# EAGLE design protoCuantumv2 (EAGLE 9.6.2)
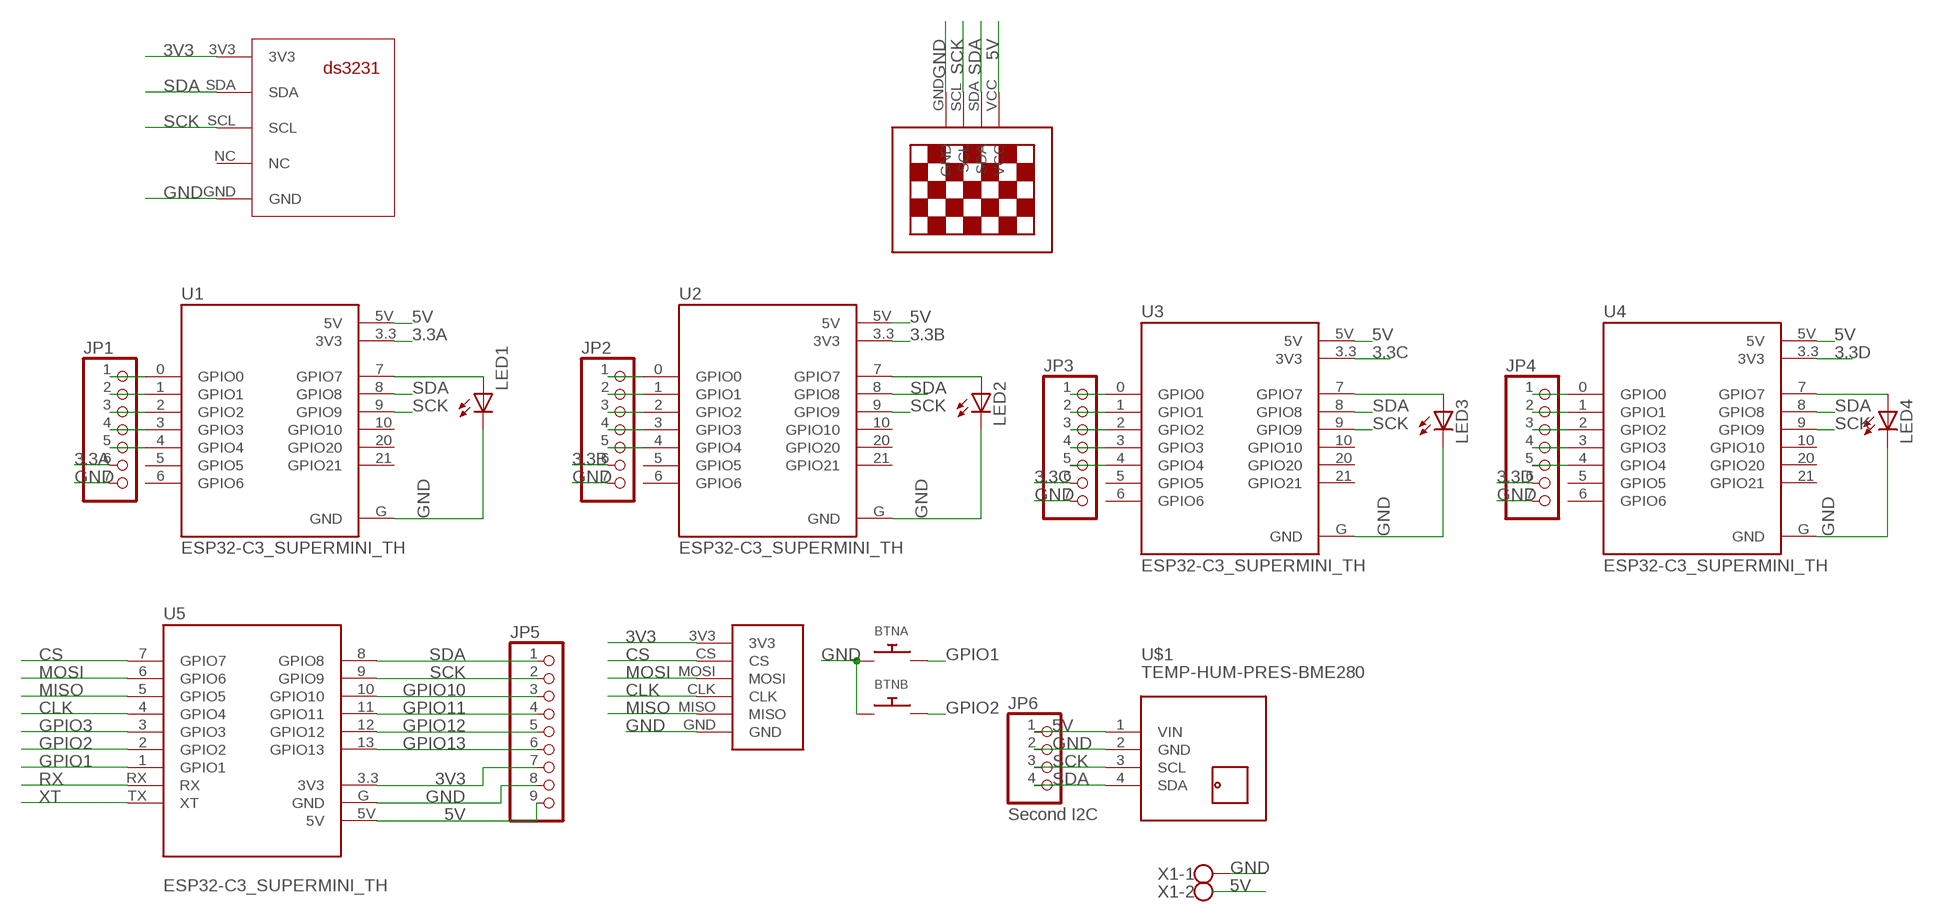
[diagram p0: schematic, sheet 1]

## Parts
BTNA  SWITCH_PUSHBUTTONEVQ-PE  [TACT_PANA-EVQ]
BTNB  SWITCH_PUSHBUTTONEVQ-PE  [TACT_PANA-EVQ]
JP1  PINHD-1X7  [1X07]
JP2  PINHD-1X7  [1X07]
JP3  PINHD-1X7  [1X07]
JP4  PINHD-1X7  [1X07]
JP5  PINHD-1X9  [1X09]
JP6  Second I2C  PINHD-1X4  [1X04]
LED1  LED3MM  [LED3MM]
LED2  LED3MM  [LED3MM]
LED3  LED3MM  [LED3MM]
LED4  LED3MM  [LED3MM]
U1  ESP32-C3_SUPERMINI_TH  [MODULE_ESP32-C3_SUPERMINI_TH]
U2  ESP32-C3_SUPERMINI_TH  [MODULE_ESP32-C3_SUPERMINI_TH]
U3  ESP32-C3_SUPERMINI_TH  [MODULE_ESP32-C3_SUPERMINI_TH]
U4  ESP32-C3_SUPERMINI_TH  [MODULE_ESP32-C3_SUPERMINI_TH]
U5  ESP32-C3_SUPERMINI_TH  [MODULE_ESP32-C3_SUPERMINI_TH]
U$1  TEMP-HUM-PRES-BME280  [TEMP-HUM-PRES-BME280]
U$2  SD_KUSKALLA  [SD_KUSKALLA]
U$3  13"OLED13"OLED  [1.3"OLED]
U$4  RTC  [RTCDS3231FP]
X1  W237-102  [W237-102]

## Nets
3.3A: JP1.6 U1.3.3(3V3)
3.3B: JP2.6 U2.3.3(3V3)
3.3C: JP3.6 U3.3.3(3V3)
3.3D: JP4.6 U4.3.3(3V3)
3V3: JP5.7 U5.3.3(3V3) U$2.3V3 U$4.3V3
5V: JP5.9 JP6.1 U1.5V U2.5V U3.5V U4.5V U5.5V U$1.1(VIN) U$3.VCC X1.2
CLK: U5.4(GPIO4) U$2.CLK
CS: U5.7(GPIO7) U$2.CS
GND: BTNA.P$1 BTNB.P$1 JP1.7 JP2.7 JP3.7 JP4.7 JP5.8 JP6.2 LED1.K(C) LED2.K(C) LED3.K(C) LED4.K(C) U1.G(GND) U2.G(GND) U3.G(GND) U4.G(GND) U5.G(GND) U$1.2(GND) U$2.GND U$3.GND U$4.GND X1.1
GPIO1: BTNA.P$2 U5.1(GPIO1)
GPIO2: BTNB.P$2 U5.2(GPIO2)
GPIO3: U5.3(GPIO3)
GPIO10: JP5.3 U5.10(GPIO10)
GPIO11: JP5.4 U5.11(GPIO11)
GPIO12: JP5.5 U5.12(GPIO12)
GPIO13: JP5.6 U5.13(GPIO13)
MISO: U5.5(GPIO5) U$2.MISO
MOSI: U5.6(GPIO6) U$2.MOSI
N$1: LED2.A U2.7(GPIO7)
N$2: JP2.1 U2.0(GPIO0)
N$3: LED1.A U1.7(GPIO7)
N$11: JP4.1 U4.0(GPIO0)
N$12: JP4.2 U4.1(GPIO1)
N$13: LED3.A U3.7(GPIO7)
N$14: LED4.A U4.7(GPIO7)
N$15: JP1.1 U1.0(GPIO0)
N$16: JP1.2 U1.1(GPIO1)
N$17: JP1.3 U1.2(GPIO2)
N$18: JP1.4 U1.3(GPIO3)
N$19: JP1.5 U1.4(GPIO4)
N$20: JP2.2 U2.1(GPIO1)
N$21: JP2.3 U2.2(GPIO2)
N$22: JP2.4 U2.3(GPIO3)
N$23: JP2.5 U2.4(GPIO4)
N$24: JP3.1 U3.0(GPIO0)
N$25: JP3.2 U3.1(GPIO1)
N$26: JP3.3 U3.2(GPIO2)
N$27: JP3.4 U3.3(GPIO3)
N$28: JP3.5 U3.4(GPIO4)
N$29: JP4.3 U4.2(GPIO2)
N$30: JP4.4 U4.3(GPIO3)
N$31: JP4.5 U4.4(GPIO4)
RX: U5.RX
SCK: JP5.2 JP6.3 U1.9(GPIO9) U2.9(GPIO9) U3.9(GPIO9) U4.9(GPIO9) U5.9(GPIO9) U$1.3(SCL) U$3.SCL U$4.SCL
SDA: JP5.1 JP6.4 U1.8(GPIO8) U2.8(GPIO8) U3.8(GPIO8) U4.8(GPIO8) U5.8(GPIO8) U$1.4(SDA) U$3.SDA U$4.SDA
XT: U5.TX(XT)
Unconnected: U1.5(GPIO5) U1.6(GPIO6) U1.10(GPIO10) U1.20(GPIO20) U1.21(GPIO21) U2.5(GPIO5) U2.6(GPIO6) U2.10(GPIO10) U2.20(GPIO20) U2.21(GPIO21) U3.5(GPIO5) U3.6(GPIO6) U3.10(GPIO10) U3.20(GPIO20) U3.21(GPIO21) U4.5(GPIO5) U4.6(GPIO6) U4.10(GPIO10) U4.20(GPIO20) U4.21(GPIO21) U$4.NC

## Library data of the parts
BTNA BTNB = adafruit:SWITCH_PUSHBUTTON: Buttons SOFTTOUCHSMD_SJ - Soft touch temporary push button (Super Junk Akihabara) Compatible with SKPMANE010 [Mouser: 688-SKPMAN] C&K_KSS = Digikey: KSS221GLFS
JP1-JP4 = pinhead:PINHD-1X7: PIN HEADER
JP5 = pinhead:PINHD-1X9: PIN HEADER
JP6 = pinhead:PINHD-1X4: PIN HEADER
LED1-LED4 = adafruit:LED: LED OSRAM: - CHIPLED LG R971, LG N971, LY N971, LG Q971, LY Q971, LO R971, LY R971 LH N974, LH R974 LS Q976, LO Q976, LY Q976 LO Q996 - Hyper CHIPLED LW Q18S LB Q993, LB Q99A, LB R99A - SideLED LS A670, LO A670, LY A670, LG A670, LP A670 LB A673, LV A673, LT A673, LW A673 LH A674 LY A675 LS A676, LA A676, LO A676, LY A676, LW A676 LS A679, LY A679, LG A679 - Hyper Micro SIDELED® LS Y876, LA Y876, LO Y876, LY Y876 LT Y87S - SmartLED LW L88C, LW L88S LB L89C, LB L89S, LG L890 LS L89K, LO L89K, LY L89K LS L896, LA L896, LO L896, LY L896 - TOPLED LS T670, LO T670, LY T670, LG T670, LP T670 LSG T670, LSP T670, LSY T670, LOP T670, LYG T670 LG T671, LOG T671, LSG T671 LB T673, LV T673, LT T673, LW T673 LH T674 LS T676, LA T676, LO T676, LY T676, LB T676, LH T676, LSB T676, LW T676 LB T67C, LV T67C, LT T67C, LS T67K, LO T67K, LY T67K, LW E67C LS E67B, LA E67B, LO E67B, LY E67B, LB E67C, LV E67C, LT E67C LW T67C LS T679, LY T679, LG T679 LS T770, LO T770, LY T770, LG T770, LP T770 LB T773, LV T773, LT T773, LW T773 LH T774 LS E675, LA E675, LY E675, LS T675 LS T776, LA T776, LO T776, LY T776, LB T776 LHGB T686 LT T68C, LB T68C - Hyper Mini TOPLED® LB M676 - Mini TOPLED Santana® LG M470 LS M47K, LO M47K, LY M47K Source: http://www.osram.convergy.de/
U1-U4 = ESP32-C3_SUPERMINI_TH:ESP32-C3_SUPERMINI_TH: Check availability <https://pricing.snapeda.com/parts/ESP32-C3%20SuperMini_TH/Espressif%20Systems/view-part?ref=eda>; AVAILABILITY: Not in stock; CHECK_PRICES: https://www.snapeda.com/parts/ESP32-C3%20SuperMini_TH/Espressif+Systems/view-part/?ref=eda; DESCRIPTION: Super tiny ESP32-C3 board; MF: Espressif Systems; MP: ESP32-C3 SuperMini_TH; PACKAGE: Package; PRICE: None; SNAPEDA_LINK: https://www.snapeda.com/parts/ESP32-C3%20SuperMini_TH/Espressif+Systems/view-part/?ref=snap
U5 = ESP32-S3_SUPERMINI_TH:ESP32-C3_SUPERMINI_TH: Biblioteca modificada para esp32 s3 super mini; AVAILABILITY: Not in stock; DESCRIPTION: Super tiny ESP32-S3; MARCA: model S3 esp32; MF: Espressif Systems; MODEL: esp32 S3; MP: ESP32-S3 SuperMini_TH; PACKAGE: Package
U$1 = diy-modules:TEMP-HUM-PRES-BME280: Digital Humidity-Temperature-Pressure Sensor based on BME280 device More information about BME280 device is available here: https://www.bosch-sensortec.com/bst/products/all_products/bme280 Click here to find device on ebay.com <http://www.ebay.com/sch/bme280+breakout>
U$2 = SD_KUSKALLA:SD_KUSKALLA
U$3 = 13oled:13"OLED
U$4 = rtc for pi ds3231:RTC
X1 = con-wago-500:W237-102: WAGO SCREW CLAMP; MPN: 237-102; OC_FARNELL: unknown; OC_NEWARK: 70K9898

## Board
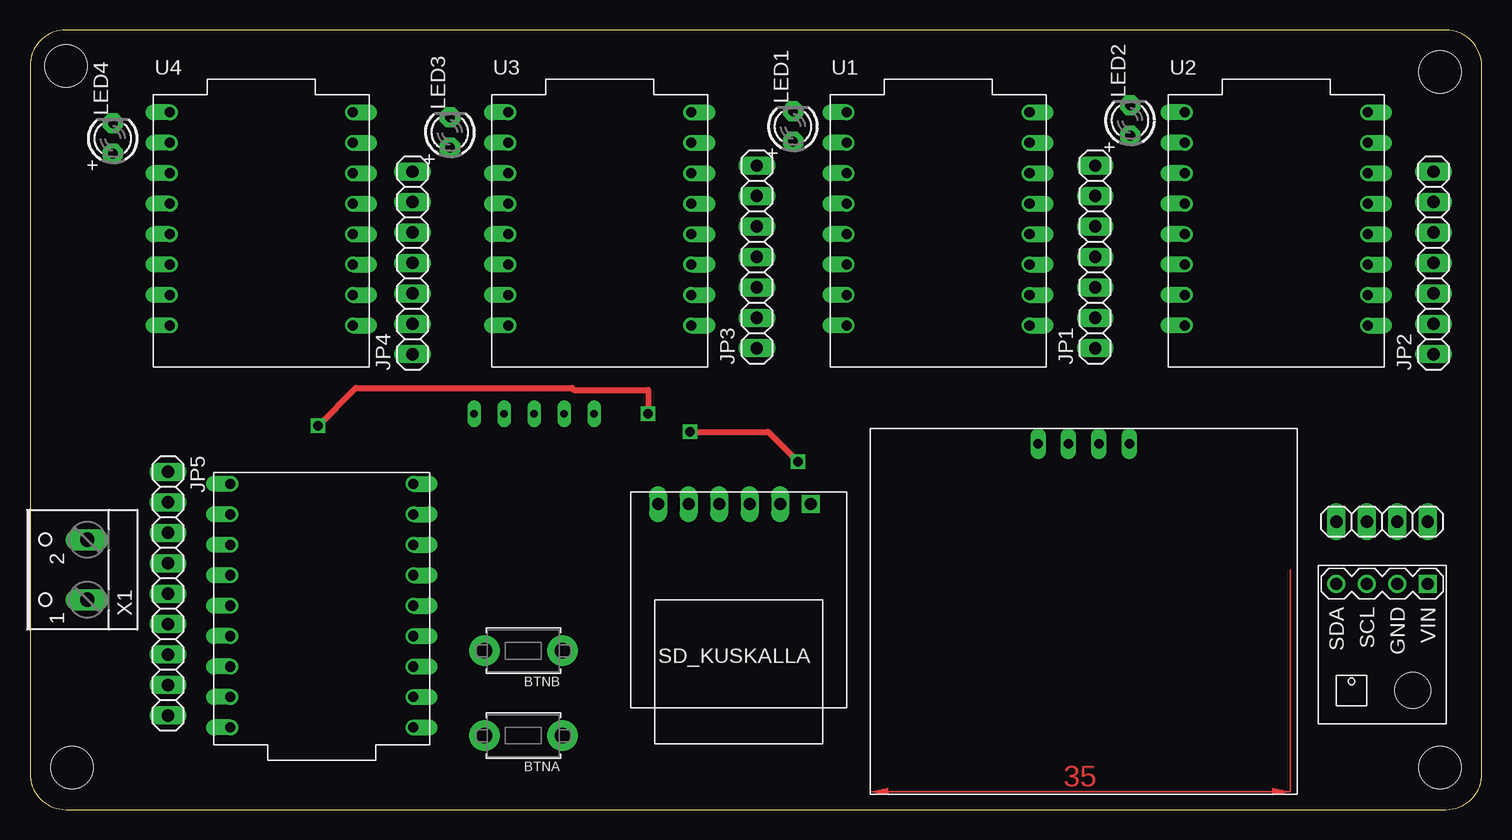
[diagram p1: board, top side]
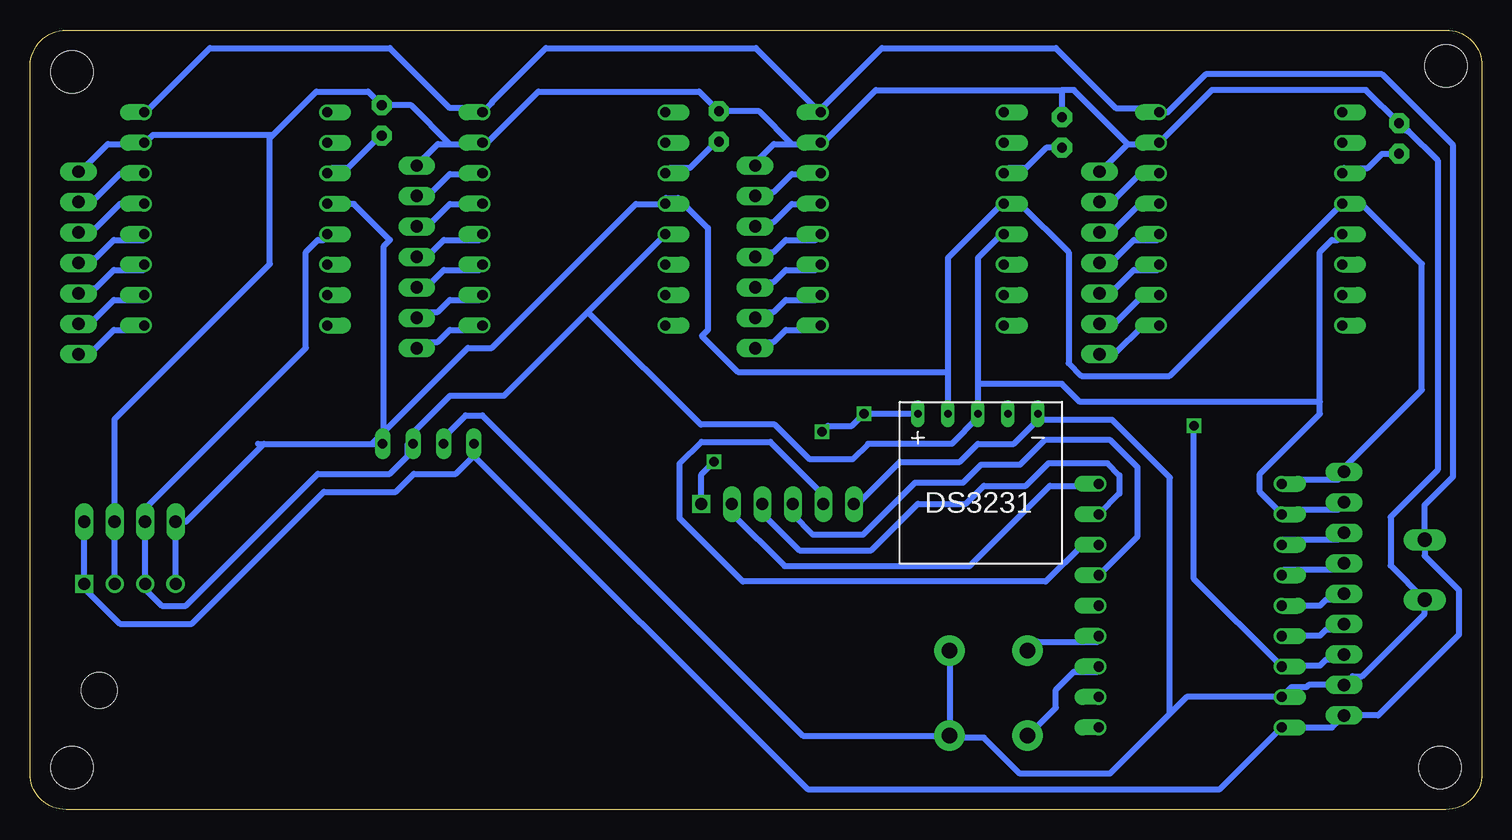
[diagram p2: board, bottom side, seen from below]

Size 121 x 65 mm. Coordinates in mm from the lower left corner, seen from the top.
Outline: 0,62 0,3 arc90 3,0 118,0 arc90 121,3 120.97,62 arc90 117.97,65 3,65 arc90 0,62
Copper layers (1*16): Top 0.035mm / dielectric 1.5mm / Bottom 0.035mm
Design rules "default *": minimum track width 0.5mm, minimum drill 0.8mm, track to track 0.8mm, track to pad 0.8mm, pad to pad 0.8mm, via to via 0.8mm, smd to smd 6mil, copper to edge 40mil, drill to drill 6mil, minimum pad ring 10mil, minimum via ring 8mil, stop-mask expansion 4mil, vias tented up to drill 0mil, thermal gap 10mil
Holes 3.5 mm at 3,62 3.5,3.5 117.5,3.5 117.5,61.5

### Footprints (pad centres in the part's own frame; a part is rotated, then mirrored left to right if it is on the bottom)
TACT_PANA-EVQ = drill 1.3 pad 2.54: P$1 -3.25,0; P$2 3.25,0
1X07 = drill 1.016 long: 1 -7.62,0; 2 -5.08,0; 3 -2.54,0; 4 0,0; 5 2.54,0; 6 5.08,0; 7 7.62,0
1X09 = drill 1.016 long: 1 -10.16,0; 2 -7.62,0; 3 -5.08,0; 4 -2.54,0; 5 0,0; 6 2.54,0; 7 5.08,0; 8 7.62,0; 9 10.16,0
1X04 = drill 1.016 long: 1 -3.81,0; 2 -1.27,0; 3 1.27,0; 4 3.81,0
LED3MM = drill 0.813 pad 1.676 octagon: A -1.27,0; K 1.27,0
MODULE_ESP32-C3_SUPERMINI_TH = drill 0.84 offset: 0 7.62,-7.88; 1 7.62,-5.34; 2 7.62,-2.8; 3 7.62,-0.26; 3.3 7.62,4.82; 4 7.62,2.28; 5 -7.62,9.9; 5V 7.62,9.9; 6 -7.62,7.36; 7 -7.62,4.82; 8 -7.62,2.28; 9 -7.62,-0.26; 10 -7.62,-2.8; 20 -7.62,-5.34; 21 -7.62,-7.88; G 7.62,7.36
MODULE_ESP32-C3_SUPERMINI_TH' = drill 0.84 offset: 1 -7.62,4.82; 2 -7.62,2.28; 3 -7.62,-0.26; 3.3 7.62,4.82; 4 -7.62,-2.8; 5 -7.62,-5.34; 5V 7.62,9.9; 6 -7.62,-7.88; 7 -7.62,-10.42; 8 7.62,-10.42; 9 7.62,-7.88; 10 7.62,-5.34; 11 7.62,-2.8; 12 7.62,-0.26; 13 7.62,2.28; G 7.62,7.36; RX -7.62,7.36; TX -7.62,9.9
TEMP-HUM-PRES-BME280 = drill 1 square: 1 -5.08,3.81 | drill 1: 2 -5.08,1.27; 3 -5.08,-1.27; 4 -5.08,-3.81 | hole 3: 3.81,2.54
SD_KUSKALLA = drill 1 square: 3V3 -8,6 | drill 1 long: CLK -8,-1.62; CS -8,3.46; GND -8,-6.7; MISO -8,-4.16; MOSI -8,0.92
1.3"OLED = drill 0.8 long: GND 2.54,0; SCL 5.08,0; SDA 7.62,0; VCC 0,0
RTCDS3231FP = drill 0.6 long: 3V3 1,12; GND 1,2; NC 1,4.5; SCL 1,7; SDA 1,9.5
W237-102 = drill 1.194 long: 1 -2.5,-1.27; 2 2.5,-1.27

### Placement (x,y rotation side)
BTNA  41.12,6.16 180 top
BTNB  41.12,13.24 180 top
JP1  88.77,46.08 90 top
JP2  116.96,45.58 90 top
JP3  60.57,46.08 90 top
JP4  31.88,45.58 90 top
JP5  11.5,18 270 top
JP6  112.68,24 180 top
LED1  63.59,56.95 90 top
LED2  91.68,57.45 90 top
LED3  35,56.45 90 top
LED4  6.91,55.95 90 top
U1  75.67,48.24 0 top
U2  103.86,48.24 0 top
U3  47.47,48.24 0 top
U4  19.28,48.24 0 top
U5  ESP32-C3_SUPERMINI_TH  [MODULE_ESP32-C3_SUPERMINI_TH']  24.32,16.74 180 top
U$1  112.68,13.74 270 top
U$2  59.05,17.47 270 top
U$3  84,30.5 0 top
U$4  35,34 270 top
X1  3.5,20 90 top

### Tracks (layer width: path | path; a pad name or v marks a point on that pad's centre or on a via)
3.3A
  Bottom 0.5: U1.3.3 83.5,53 86,53 87.5,51.5 88.5,51.5 JP1.6
3.3B
  Bottom 0.5: U2.3.3 111.5,53 113.5,53 115.5,51 116.5,51 JP2.6
3.3C
  Bottom 0.5: U3.3.3 55.5,53 57.5,53 59,51.5 60.5,51.5 JP3.6
3.3D
  Bottom 0.5: U4.3.3 27,53 28.5,53 30.5,51 31.5,51 JP4.6
3V3  (via drill 0.8)
  Top 0.5: v24,32 27.16,35.16 45.16,35.16 45.32,35 51.5,35 v51.5,33 | v55,31.5 61.5,31.5 v64,29
  Bottom 0.5: JP5.7 11.5,12.5 13,12.5 13.5,12 16.5,12 U5.3.3 24,19.22 v24,32 | U$4.3V3 v51.5,33 52.5,32 54.5,32 v55,31.5 | U$2.3V3 65.05,27.95 v64,29
5V
  Bottom 0.5: U2.5V 111,58.5 106,63.5 91,63.5 86,58.5 83.65,58.5 U1.5V 82.5,58.93 82.5,59 78,63.5 60.5,63.5 55.5,58.5 U3.5V 55,58.5 50,63.5 35.5,63.5 30.5,58.5 27,58.5 U4.5V 26.2,58.14 23.04,61.3 8.32,61.3 2.4,55.38 2.4,27.76 4.77,25.39 X1.2 4.77,21.15 1.93,18.31 1.93,14.57 8.66,7.84 JP5.9 12.5,6.84 U5.5V 21.84,1.7 56.2,1.7 84,29.5 | 84,29.5 85.5,28 89,28 90.5,26.5 96.5,26.5 107.5,15.5 113.5,15.5 116.5,18.5 U$1.1 JP6.1 | U$3.VCC 84,29.5
CLK
  Bottom 0.5: U5.4 28.7,22.78 28.7,28.54 30.96,30.8 36.45,30.8 38.5,28.75 41.75,28.75 43.25,27.25 47.27,27.25 51.6,22.91 55.75,22.91 57.43,24.59 57.43,24.72 U$2.CLK
CS
  Bottom 0.5: U5.7 32.1,27 36,27 42.69,20.31 58.12,20.31 62.51,24.7 U$2.CS
GND
  Bottom 0.5: 37,32.5 39,30.5 42,30.5 43.5,29 48.5,29 52,25.5 U$2.GND | 37,32.5 U$4.GND | 26,8 31,3 38.5,3 41.5,6 44,6 BTNA.P$1 | 29.5,55.5 27,55.5 U4.G 26.5,56 22.5,60 9.69,60 LED4.K 6.26,56.57 6.13,56.57 3.7,54.14 3.7,28.3 7.61,24.39 7.61,20.34 X1.1 4.77,16.32 9.99,11.11 10.77,11.11 JP5.8 14.45,10.38 14.64,10.2 15.88,10.2 U5.G 24.62,9.38 26,8 | 29.5,55.5 31.5,53.5 JP4.7 | 35,60 34,60 29.5,55.5 | 57.5,55.5 59,55.5 60.5,54 JP3.7 | 57.5,55.5 55.5,55.5 U3.G 55,55.5 50.5,60 35,60 | 86,55.5 87,55.5 88.5,54 JP1.7 | 86,55.5 83.5,55.5 U1.G 82.9,55.6 78.64,59.86 65.23,59.86 LED1.K 60.22,58.22 57.5,55.5 | 100.75,56.25 101,56 101,45.5 113.95,32.55 JP6.2 U$1.2 | 35,60 LED3.K | 111.5,55.5 114.5,55.5 116.5,53.5 JP2.7 | 111.5,55.5 U2.G | BTNB.P$1 BTNA.P$1 | BTNA.P$1 56.6,6.16 83.29,32.86 84.71,32.86 86.54,31.02 U$3.GND | 100.75,56.25 110.75,56.25 111.5,55.5 | 26,8 26,27.68 30.82,32.5 37,32.5 | 86,55.5 89.22,58.72 LED2.K 92.82,59.86 97.14,59.86 100.75,56.25
GPIO1
  Bottom 0.5: U5.1 32,11.5 34,11.5 35.5,10 35.5,8.5 37.5,6.5 BTNA.P$2
GPIO2
  Bottom 0.5: U5.2 32,14 37,14 37.5,13.5 BTNB.P$2
GPIO10
  Bottom 0.5: U5.10 16.5,22.5 12,22.5 11.5,23 JP5.3
GPIO11
  Bottom 0.5: U5.11 16.5,20 12,20 11.5,20.5 JP5.4
GPIO12
  Bottom 0.5: U5.12 13.5,17 13,17.5 12,17.5 JP5.5
GPIO13
  Bottom 0.5: U5.13 16.5,14.5 13.5,14.5 13,15 11.5,15 JP5.6
MISO
  Bottom 0.5: U5.5 33.29,22.08 36.36,19.01 61.59,19.01 66.85,24.28 66.85,28.84 65.04,30.65 59.31,30.65 54.89,26.23 U$2.MISO
MOSI
  Bottom 0.5: U$2.MOSI 59.97,24.7 56.88,21.61 50.89,21.61 47,25.5 43,25.5 41.5,27 38,27 36.12,28.88 31.23,28.88 30.22,27.87 30.22,26.34 U5.6
N$1
  Bottom 0.5: LED2.A 91.82,56.18 94.5,53.5 95.8,53.5 U2.7
N$2
  Bottom 0.5: U2.0 111.5,40 114,40 116.5,37.5 JP2.1
N$3
  Bottom 0.5: LED1.A 63.82,55.68 66,53.5 67.61,53.5 U1.7
N$11
  Bottom 0.5: U4.0 28.25,40.36 30.65,37.96 31.11,37.96 JP4.1
N$12
  Bottom 0.5: U4.1 28.25,42.9 30.65,40.5 31.11,40.5 JP4.2
N$13
  Bottom 0.5: U3.7 39.41,53.5 38,53.5 36.32,55.18 LED3.A
N$14
  Bottom 0.5: U4.7 11.5,53.5 9.5,53.5 8.32,54.68 LED4.A
N$15
  Bottom 0.5: U1.0 83.5,40 86,40 87,39 88,39 88.5,38.5 JP1.1
N$16
  Bottom 0.5: U1.1 83.5,42.5 86,42.5 87,41.5 88,41.5 88.5,41 JP1.2
N$17
  Bottom 0.5: U1.2 83.5,45 86.5,45 87.5,44 88.5,44 JP1.3
N$18
  Bottom 0.5: U1.3 83.5,47.5 86.5,47.5 87.5,46.5 88.5,46.5 JP1.4
N$19
  Bottom 0.5: U1.4 83.5,50.5 86,50.5 87.5,49 88.5,49 JP1.5
N$20
  Bottom 0.5: JP2.2 116,40.5 114,42.5 111.5,42.5 U2.1
N$21
  Bottom 0.5: U2.2 111.5,45 114,45 115.5,43.5 116.5,43.5 JP2.3
N$22
  Bottom 0.5: U2.3 111.5,47.5 114,47.5 115.5,46 116.5,46 JP2.4
N$23
  Bottom 0.5: U2.4 111.5,50.5 113.5,50.5 115.5,48.5 116.5,48.5 JP2.5
N$24
  Bottom 0.5: U3.0 55.5,40 58,40 59,39 60,39 60.5,38.5 JP3.1
N$25
  Bottom 0.5: U3.1 55.5,42.5 58,42.5 59,41.5 60,41.5 60.5,41 JP3.2
N$26
  Bottom 0.5: U3.2 55.5,45 58,45 59,44 60.5,44 JP3.3
N$27
  Bottom 0.5: U3.3 55.5,47.5 58,47.5 59,46.5 60.5,46.5 JP3.4
N$28
  Bottom 0.5: U3.4 55.5,50.5 57.5,50.5 59,49 60.5,49 JP3.5
N$29
  Bottom 0.5: U4.2 27,45 29,45 30.5,43.5 31.5,43.5 JP4.3
N$30
  Bottom 0.5: U4.3 27,47.5 29,47.5 30.5,46 31.5,46 JP4.4
N$31
  Bottom 0.5: U4.4 27,50.5 28.5,50.5 30.5,48.5 31.5,48.5 JP4.5
SCK
  Bottom 0.5: 42,35.5 42,46 40,48 U3.9 | 42,35.5 U$4.SCL 42,32.68 44.18,30.5 51.16,30.5 52.46,29.2 56.02,29.2 58.92,32.1 65.1,32.1 74.5,41.5 | JP5.2 11.5,25.5 12,25 16.5,25 U5.9 17,25 18.5,26.5 18.5,28 13.5,33 13.5,34 | 13.5,34 13.5,46.5 12.5,47.5 12,47.5 U4.9 | 42,35.5 35,35.5 33.5,34 13.5,34 | 74.5,41.5 68.5,47.5 U1.9 | 74.5,41.5 81.5,34.5 86,34.5 89,31.5 89,30.5 U$3.SCL 89.5,30.5 89.5,29.5 91,28 97,28 108,17 110,17 111.5,18.5 U$1.3 | U2.9 96.5,47.5 97,47.5 98,46.5 98,38.5 110.75,25.75 111,25.5 111.41,25.09 JP6.3 U$1.3 | 111.5,19 U$1.3
SDA
  Bottom 0.5: U5.8 16.5,27.5 12,27.5 11.5,28 JP5.1 11.5,28.5 5,35 5,45.5 10,50.5 11.5,50.5 U4.8 26.03,36.15 33.39,36.15 34.45,37.21 34.45,46.46 38.51,50.52 U3.8 40,50.5 44.5,46 44.5,36.5 | 44.5,36.5 U$4.SDA | 102,30.5 101.5,30.5 | 101.5,30.5 92.5,30.5 | 92.5,30.5 U$3.SDA 91.5,31.5 | 92.5,30.5 91.5,31.5 | 91.5,31.5 84.5,38.5 82.5,38.5 70.5,50.5 68.5,50.5 U1.8 68,51 67,51 64.5,48.5 64.5,40 65,39.5 62,36.5 44.5,36.5 | 91.5,31.5 91.5,47 91,47.5 94,50.5 96,50.5 U2.8 | 101.5,30.5 108,24 JP6.4 U$1.4
(copper drawn outside any net)
  shapes: Top area x1